# Altium schematic sheet 28_Clocks1.SchDoc: Clocks 1
size A3; Organization: Lime Microsystems; Address1: Surrey Tech Centre; Address2: Guildford GU2 7YG; Address3: Surrey; Address4: United Kingdom; Revision: v1.1; SheetNumber: 28; SheetTotal: 31
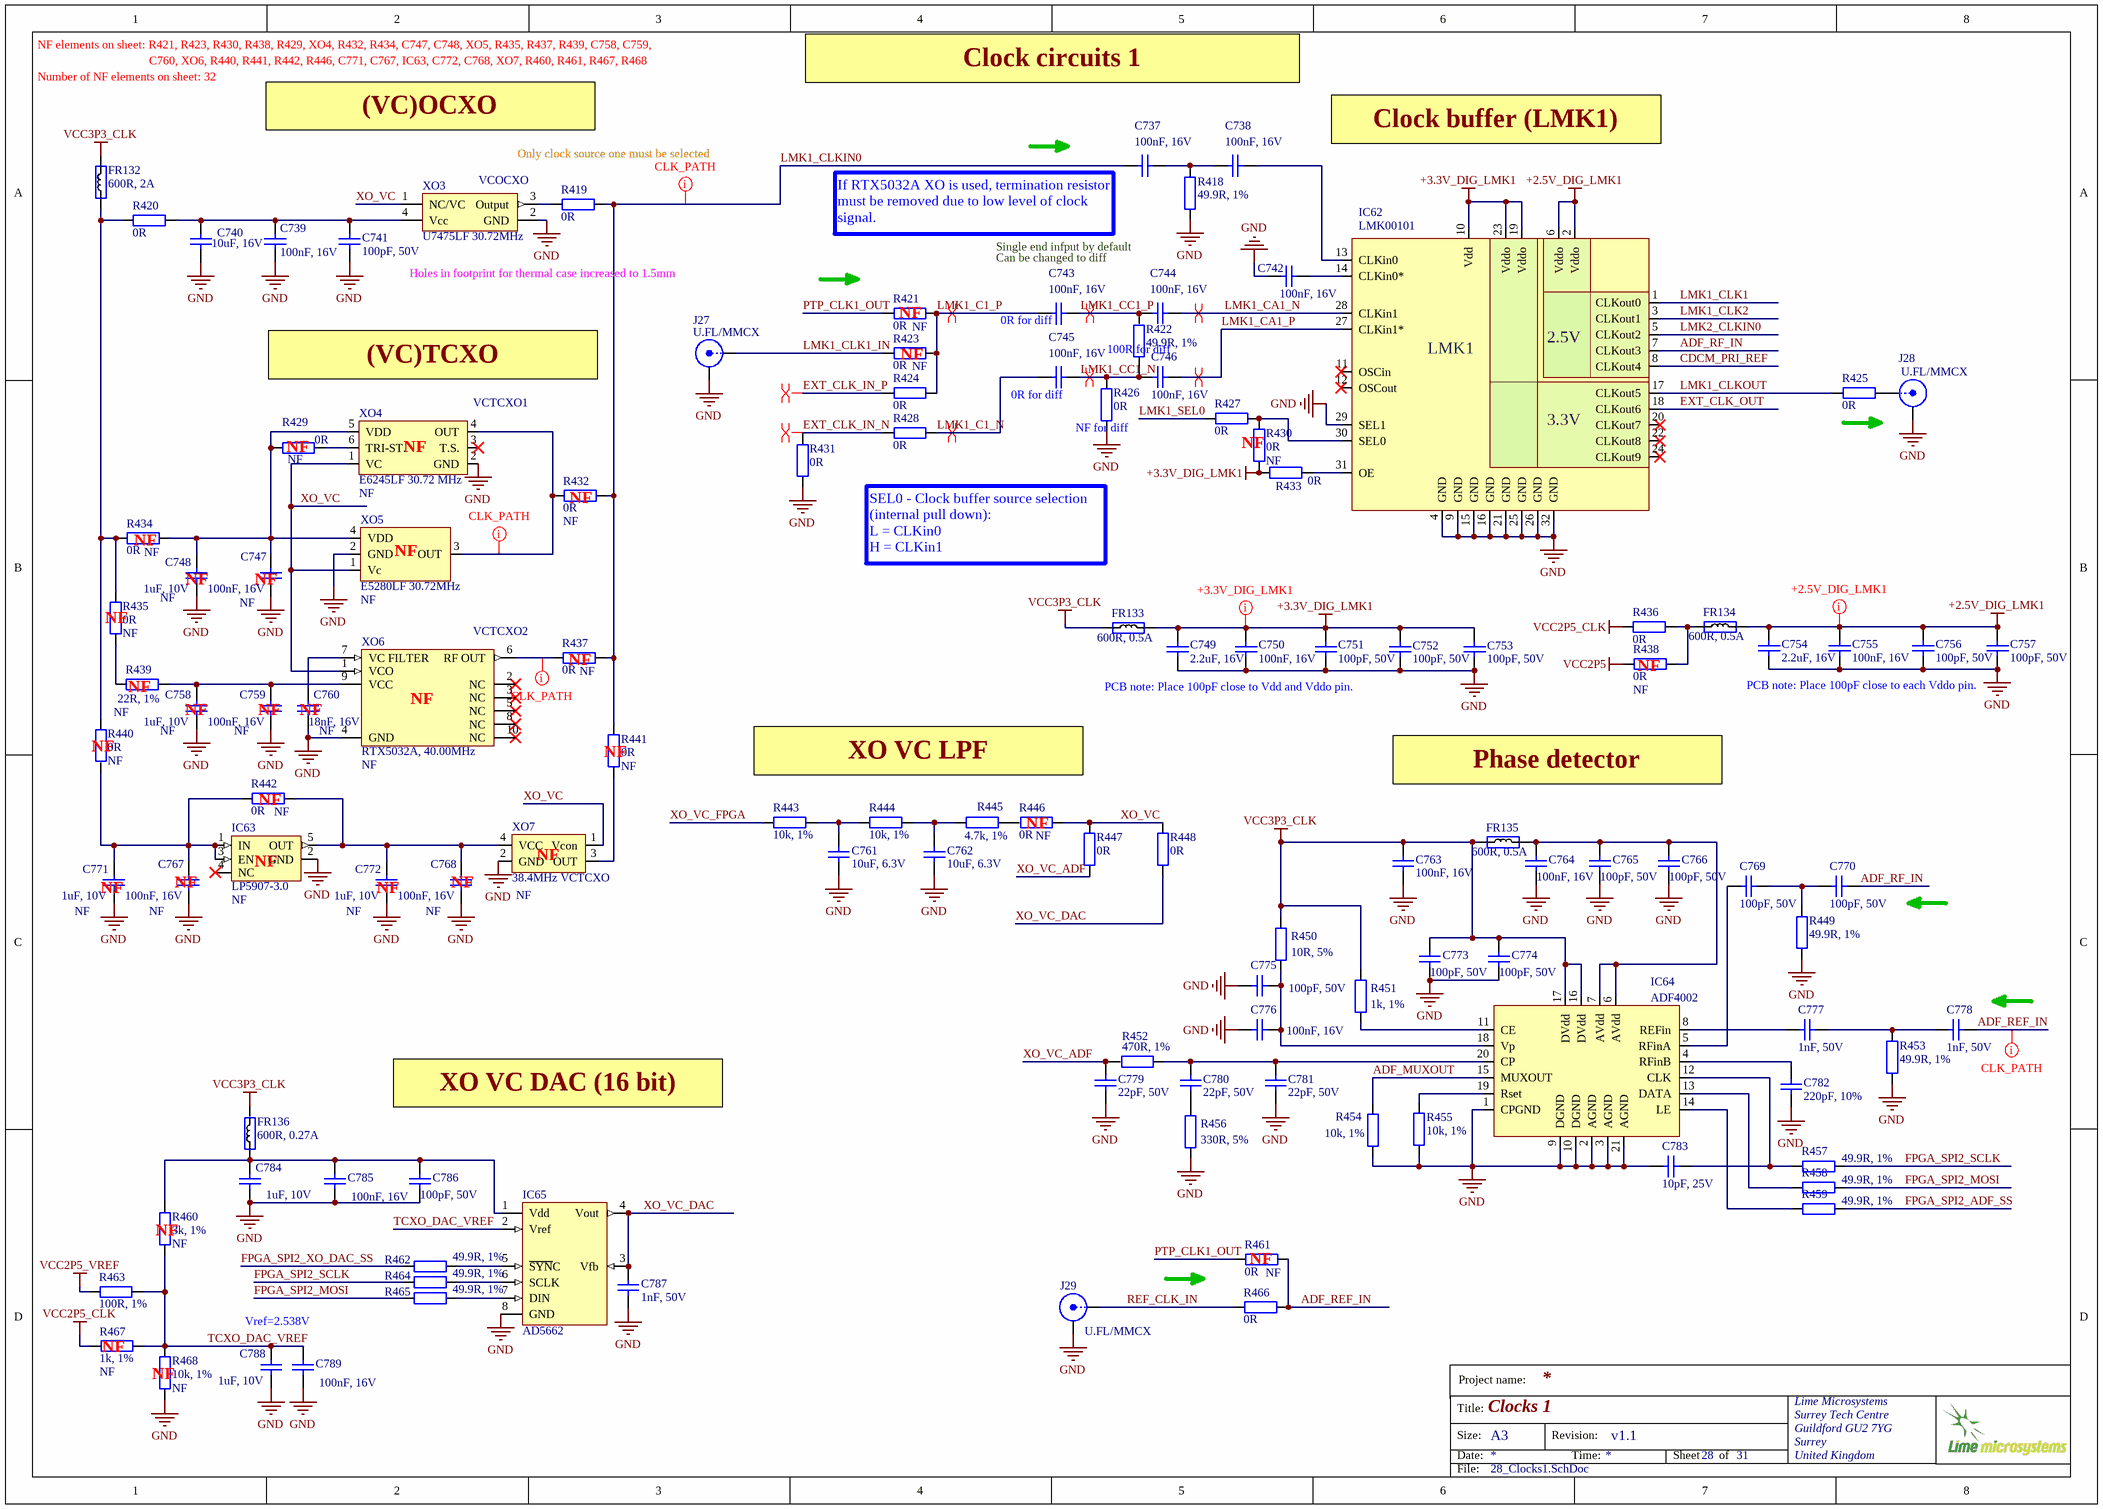
[diagram p0: 28_Clocks1.SchDoc]

## Parts
C737  100nF, 16V  [CAP0402]
C738  100nF, 16V  [CAP0402]
C739  100nF, 16V  [CAP0402]
C740  10uF, 16V  [CAP0603]
C741  100pF, 50V  [CAP0402]
C742  100nF, 16V  [CAP0402]
C743  100nF, 16V  [CAP0402]
C744  100nF, 16V  [CAP0402]
C745  100nF, 16V  [CAP0402]
C746  100nF, 16V  [CAP0402]
C747  100nF, 16V  Assembly Info: NF  [CAP0402]
C748  1uF, 10V  Assembly Info: NF  [CAP0402]
C749  2.2uF, 16V  [CAP0402]
C750  100nF, 16V  [CAP0402]
C751  100pF, 50V  [CAP0402]
C752  100pF, 50V  [CAP0402]
C753  100pF, 50V  [CAP0402]
C754  2.2uF, 16V  [CAP0402]
C755  100nF, 16V  [CAP0402]
C756  100pF, 50V  [CAP0402]
C757  100pF, 50V  [CAP0402]
C758  1uF, 10V  Assembly Info: NF  [CAP0402]
C759  100nF, 16V  Assembly Info: NF  [CAP0402]
C760  18nF, 16V  Assembly Info: NF  [CAP0402]
C761  10uF, 6.3V  [CAP0603]
C762  10uF, 6.3V  [CAP0603]
C763  100nF, 16V  [CAP0402]
C764  100nF, 16V  [CAP0402]
C765  100pF, 50V  [CAP0402]
C766  100pF, 50V  [CAP0402]
C767  100nF, 16V  Assembly Info: NF  [CAP0402]
C768  100nF, 16V  Assembly Info: NF  [CAP0402]
C769  100pF, 50V  [CAP0402]
C770  100pF, 50V  [CAP0402]
C771  1uF, 10V  Assembly Info: NF  [CAP0402]
C772  1uF, 10V  Assembly Info: NF  [CAP0402]
C773  100pF, 50V  [CAP0402]
C774  100pF, 50V  [CAP0402]
C775  100pF, 50V  [CAP0402]
C776  100nF, 16V  [CAP0402]
C777  1nF, 50V  [CAP0402]
C778  1nF, 50V  [CAP0402]
C779  22pF, 50V  [CAP0402]
C780  22pF, 50V  [CAP0402]
C781  22pF, 50V  [CAP0402]
C782  220pF, 10%  [CAP0402]
C783  10pF, 25V  [CAP0402]
C784  1uF, 10V  [CAP0402]
C785  100nF, 16V  [CAP0402]
C786  100pF, 50V  [CAP0402]
C787  1nF, 50V  [CAP0402]
C788  1uF, 10V  [CAP0402]
C789  100nF, 16V  [CAP0402]
FR132  600R, 2A  [RES0805]
FR133  value 600R, 0.5A  [RES0402]  (hidden comment: Ferrite)
FR134  value 600R, 0.5A  [RES0402]  (hidden comment: Ferrite)
FR135  value 600R, 0.5A  [RES0402]  (hidden comment: Ferrite)
FR136  value 600R, 0.27A  [RES0201]  (hidden comment: Ferrite)
IC62  LMK00101  [LMK00101_WQFN32]
IC63  LP5907-3.0  Assembly Info: NF  [SOT23-5]
IC64  ADF4002  [ADF4002]
IC65  AD5662  [AD5662_SOT23-8]
J27  U.FL/MMCX  [MMCX_UFL_conn_u]
J28  U.FL/MMCX  [MMCX_UFL_conn_u]
J29  U.FL/MMCX  [MMCX_UFL_conn_u]
R418  49.9R, 1%  [RES0402]
R419  0R  [RES0402_v2]
R420  0R  [RES0402]
R421  0R  Assembly Info: NF  [RES0402_v2]
R422  49.9R, 1%  [RES0402]
R423  0R  Assembly Info: NF  [RES0402_v2]
R424  0R  [RES0402_v2]
R425  0R  [RES0402]
R426  0R  [RES0402]
R427  0R  [RES0402]
R428  0R  [RES0402_v2]
R429  0R  Assembly Info: NF  [RES0402]
R430  0R  Assembly Info: NF  [RES0402]
R431  0R  [RES0402]
R432  0R  Assembly Info: NF  [RES0402_v2]
R433  0R  [RES0402]
R434  0R  Assembly Info: NF  [RES0402]
R435  0R  Assembly Info: NF  [RES0402]
R436  0R  [RES0402]
R437  0R  Assembly Info: NF  [RES0402_v2]
R438  0R  Assembly Info: NF  [RES0402]
R439  22R, 1%  Assembly Info: NF  [RES0402]
R440  0R  Assembly Info: NF  [RES0402]
R441  0R  Assembly Info: NF  [RES0402_v2]
R442  0R  Assembly Info: NF  [RES0402]
R443  10k, 1%  [RES0402]
R444  10k, 1%  [RES0402]
R445  4.7k, 1%  [RES0402]
R446  0R  Assembly Info: NF  [RES0402]
R447  0R  [RES0402]
R448  0R  [RES0402]
R449  49.9R, 1%  [RES0402]
R450  10R, 5%  [RES0402]
R451  1k, 1%  [RES0402]
R452  470R, 1%  [RES0402]
R453  49.9R, 1%  [RES0402]
R454  10k, 1%  [RES0402]
R455  10k, 1%  [RES0402]
R456  330R, 5%  [RES0402]
R457  49.9R, 1%  [RES0402]
R458  49.9R, 1%  [RES0402]
R459  49.9R, 1%  [RES0402]
R460  3k, 1%  Assembly Info: NF  [RES0402]
R461  0R  Assembly Info: NF  [RES0402]
R462  49.9R, 1%  [RES0402]
R463  100R, 1%  [RES0402]
R464  49.9R, 1%  [RES0402]
R465  49.9R, 1%  [RES0402]
R466  0R  [RES0402]
R467  1k, 1%  Assembly Info: NF  [RES0402]
R468  10k, 1%  Assembly Info: NF  [RES0402]
XO3  U7475LF 30.72MHz  [AOCJYR-10.000MHz]
XO4  E6245LF 30.72 MHz  Assembly Info: NF  [RAKON_RPT7050A]
XO5  E5280LF 30.72MHz  Assembly Info: NF  [RAKON_TXCO]
XO6  RTX5032A, 40.00MHz  Assembly Info: NF  [RAKON_RTX5032A]
XO7  38.4MHz VCTCXO  Assembly Info: NF  [CRYSTAL_4-LCC_2P5x2P0]

## Nets
+2.5V_DIG_LMK1: C754.2 C755.2 C756.2 C757.2 FR134.2 IC62.2(Vddo) IC62.6(Vddo)
+3.3V_DIG_LMK1: C749.2 C750.2 C751.2 C752.2 C753.2 FR133.2 IC62.10(Vdd) IC62.19(Vddo) IC62.23(Vddo) R430.2 R433.1
GND: C739.1 C740.1 C741.2 C742.1 C747.1 C748.1 C749.1 C750.1 C751.1 C752.1 C753.1 C754.1 C755.1 C756.1 C757.1 C758.1 C759.1 C760.1 C761.2 C762.2 C763.1 C764.1 C765.2 C766.2 C767.1 C768.1 C771.1 C772.1 C773.2 C774.2 C775.1 C776.2 C779.1 C781.1 C782.2 C783.1 C784.1 C785.2 C786.2 C787.2 C788.1 C789.2 IC62.4(GND) IC62.9(GND) IC62.15(GND) IC62.16(GND) IC62.21(GND) IC62.25(GND) IC62.26(GND) IC62.29(SEL1) IC62.32(GND) IC63.2(GND) IC64.1(CPGND) IC64.2(AGND) IC64.3(AGND) IC64.9(DGND) IC64.10(DGND) IC64.21(AGND) IC65.8(GND) J27.2(Y) J28.2(Y) J29.2(Y) R418.1 R426.1 R431.1 R449.1 R453.1 R454.2 R455.2 R456.1 R468.2 XO3.2(GND) XO4.2(GND) XO5.2(GND) XO6.4(GND) XO7.2(GND)
VCC2P5: R438.2
VCC2P5_CLK: R436.1 R467.2
VCC2P5_VREF: R463.1
VCC3P3_CLK: C763.2 C773.1 C774.1 FR132.1 FR133.1 FR135.1 FR136.2 IC64.16(DVdd) IC64.17(DVdd) R450.2 R451.2
ADF_MUXOUT: IC64.15(MUXOUT) R454.1
ADF_REF_IN: C778.1 R461.1 R466.2
ADF_RF_IN: C770.2 IC62.7(CLKout3)
CDCM_PRI_REF: IC62.8(CLKout4)
EXT_CLK_IN_N: R428.2 R431.2
EXT_CLK_IN_P: R424.2
EXT_CLK_OUT: IC62.18(CLKout6)
FPGA_SPI2_ADF_SS: R459.1
FPGA_SPI2_MOSI: R458.1 R465.2
FPGA_SPI2_SCLK: R457.1 R464.2
FPGA_SPI2_XO_DAC_SS: R462.2
LMK1_C1_N: C745.2 R428.1
LMK1_C1_P: C743.2 R421.1 R423.1 R424.1
LMK1_CA1_N: C744.1 IC62.28(CLKin1)
LMK1_CA1_P: C746.1 IC62.27(CLKin1*)
LMK1_CC1_N: C745.1 C746.2 R422.1 R426.2
LMK1_CC1_P: C743.1 C744.2 R422.2
LMK1_CLK1: IC62.1(CLKout0)
LMK1_CLK1_IN: J27.1(X) R423.2
LMK1_CLK2: IC62.3(CLKout1)
LMK1_CLKIN0: C737.2 R419.1 R432.1 R437.2 R441.1
LMK1_CLKOUT: IC62.17(CLKout5) R425.2
LMK1_SEL0: R427.1
LMK2_CLKIN0: IC62.5(CLKout2)
PTP_CLK1_OUT: R421.2 R461.2
REF_CLK_IN: J29.1(X) R466.1
TCXO_DAC_VREF: C788.2 C789.1 IC65.2(Vref) R460.1 R463.2 R467.1 R468.1
XO_VC: R446.1 R447.1 R448.1 XO3.1(NC/VC) XO4.1(VC) XO5.1(Vc) XO6.1(VCO) XO7.1(Vcon)
XO_VC_ADF: C779.2 R447.2 R452.2
XO_VC_DAC: C787.1 IC65.3(Vfb) IC65.4(Vout) R448.2
XO_VC_FPGA: R443.1
NetC737_1: C737.1 C738.2 R418.2
NetC738_1: C738.1 IC62.13(CLKin0)
NetC739_2: C739.2 C740.2 C741.1 R420.2 XO3.4(Vcc)
NetC742_2: C742.2 IC62.14(CLKin0*)
NetC747_2: C747.2 C748.2 R429.2 R434.1 XO4.5(VDD) XO5.4(VDD)
NetC758_2: C758.2 C759.2 R439.2 XO6.9(VCC)
NetC760_2: C760.2 XO6.7(VC_FILTER)
NetC761_1: C761.1 R443.2 R444.1
NetC762_1: C762.1 R444.2 R445.2
NetC764_2: C764.2 C765.1 C766.1 FR135.2 IC64.6(AVdd) IC64.7(AVdd)
NetC767_2: C767.2 C771.2 IC63.1(IN) IC63.3(EN) R440.2 R442.2
NetC768_2: C768.2 C772.2 IC63.5(OUT) R442.1 XO7.4(VCC)
NetC769_1: C769.1 IC64.5(RFinA)
NetC769_2: C769.2 C770.1 R449.2
NetC775_2: C775.2 C776.1 IC64.18(Vp) R450.1
NetC777_1: C777.1 C778.2 R453.2
NetC777_2: C777.2 IC64.8(REFin)
NetC780_1: C780.1 R456.2
NetC780_2: C780.2 C781.2 IC64.20(CP) R452.1
NetC782_1: C782.1 IC64.4(RFinB)
NetC783_2: C783.2 IC64.12(CLK) R457.2
NetC784_2: C784.2 C785.1 C786.1 FR136.1 IC65.1(Vdd) R460.2
NetFR132_2: FR132.2 R420.1 R434.2 R435.1 R440.1
NetFR134_1: FR134.1 R436.2 R438.1
NetIC62_30: IC62.30(SEL0) R427.2 R430.1
NetIC62_31: IC62.31(OE) R433.2
NetIC64_11: IC64.11(CE) R451.1
NetIC64_13: IC64.13(DATA) R458.2
NetIC64_14: IC64.14(LE) R459.2
NetIC64_19: IC64.19(Rset) R455.1
NetIC65_5: IC65.5(~{SYN}C) R462.1
NetIC65_6: IC65.6(SCLK) R464.1
NetIC65_7: IC65.7(DIN) R465.1
NetJ28_1: J28.1(X) R425.1
NetR419_2: R419.2 XO3.3(Output)
NetR429_1: R429.1 XO4.6(TRI-ST.)
NetR432_2: R432.2 XO4.4(OUT) XO5.3(OUT)
NetR435_2: R435.2 R439.1
NetR437_1: R437.1 XO6.6(RF_OUT)
NetR441_2: R441.2 XO7.3(OUT)
NetR445_1: R445.1 R446.2

Not connected (* = marked no-connect by the designer): IC62 11(OSCin)* 12(OSCout)* 20(CLKout7)* 22(CLKout8)* 24(CLKout9)*; IC63 4(NC)*; XO4 3(T.S.)*; XO6 2(NC)* 3(NC)* 5(NC)* 8(NC)* 10(NC)*

## Layout directives
net class CLK_PATH: ADF_REF_IN, LMK1_CLKIN0, NetR432_2, NetR437_1
net class +1.8V_DIG_LMK: +2.5V_DIG_LMK1
net class +3.3V_DIG_LMK: +3.3V_DIG_LMK1
differential pair: EXT_CLK_IN_N, EXT_CLK_IN_P, LMK1_C1_N, LMK1_C1_P, LMK1_CA1_N, LMK1_CA1_P, LMK1_CC1_N, LMK1_CC1_P

## Notes on the sheet
- NF elements on sheet: R421, R423, R430, R438, R429, XO4, R432, R434, C747, C748, XO5, R435, R437, R439, C758, C759,
- Number of NF elements on sheet: 32
- C760, XO6, R440, R441, R442, R446, C771, C767, IC63, C772, C768, XO7, R460, R461, R467, R468
- Clock circuits 1
- (VC)OCXO
- Only clock source one must be selected
- Clock buffer (LMK1)
- (near XO3) VCOCXO
- (near C737) If RTX5032A XO is used, termination resistor must be removed due to low level of clock signal.
- Single end infput by default
- Holes in footprint for thermal case increased to 1.5mm
- (near R421) NF
- Can be changed to diff
- (VC)TCXO
- (near R423) NF
- (near C743) 0R for diff
- (near R422) 100R for diff
- (near IC62) LMK1
- (near IC62) 2.5V
- (near R429) NF
- (near XO4) NF
- (near XO4) VCTCXO1
- (near C745) 0R for diff
- (near R426) NF for diff
- (near R430) NF
- (near IC62) 3.3V
- (near R432) NF
- (near R434) NF
- (near C748) NF
- (near C747) NF
- (near XO5) NF
- SEL0 - Clock buffer source selection (internal pull down):
  L = CLKin0
  H = CLKin1
- (near R435) NF
- (near XO6) VCTCXO2
- (near R439) NF
- (near C758) NF
- (near C759) NF
- (near C760) NF
- (near XO6) NF
- (near R437) NF
- PCB note: Place 100pF close to Vdd and Vddo pin.
- (near R438) NF
- PCB note: Place 100pF close to each Vddo pin.
- (near R440) NF
- (near R441) NF
- XO VC LPF
- Phase detector
- (near R442) NF
- (near R446) NF
- (near C771) NF
- (near C767) NF
- (near IC63) NF
- (near C772) NF
- (near C768) NF
- (near XO7) NF
- XO VC DAC (16 bit)
- (near R460) NF
- Vref=2.538V
- (near R461) NF
- (near R467) NF
- (near R468) NF
- Project name:
- Title:
- Size:
- Date:
- A3
- Revision:
- Time:
- Sheet
- of
- File:

## Library data of the parts
C737-C739 C742 C743 C745 C747 C750 C755 C759 C763 C764 C776 = Cap_0402: Manufacturer: Murata Electronics; Manufacturer Part Number: GRM155R71C104KA88D; Part Description: 0.10µF ±10% 16V X7R Ceramic Capacitor -55°C ~ 125°C Surface Mount, MLCC 0402 (1005 Metric) 0.039" L x 0.020" W (1.00mm x 0.50mm); Tolerance: 10 %; Type: General Purpose MLCC; Capacitance: 0.1 uF; Case Length: 1 mm; Dielectric: X7R; Case Height: 0.5 mm; Temperature Coefficient / Code: +/- 15 %; Value: 100nF, 16V; Supplier 1: Mouser; Supplier Part Number 1: 81-GRM155R71C104KA88; Case Code - in: 0402; RoHS: RoHS Compliant; Operating Temperature Range: - 55 C to + 125 C; Series: GRM; Termination Style: SMD/SMT; Package / Case: 0402 (1005 metric); Voltage Rating DC: 16 V; Maximum Operating Temperature: + 125 C; Case Code - mm: 1005; Minimum Operating Temperature: - 55 C; Product Category: Low & Medium Capacitance SMD Ceramic Chip Capacitors; Packaging: Reel; Product: General Type MLCCs; Category: Multilayer Ceramic Capacitors MLCC - SMD/SMT; Brand: Murata Electronics; Case Width: 0.5 mm; RoHS - Mouser: Y; Standard Pack Qty: 10000; Minimum Order Quantity: 1; Reeling: True; Manufacturer Part Number 1: GRM155R71C104KA88D
C740 = Cap_0603: Manufacturer: Yageo; Manufacturer Part Number 1: GRM188R61C106MA73D; Part Description: 10µF ±20% 16V Ceramic Capacitor X5R 0603 (1608 Metric); Temperature Coefficient: X5R; Capacitance: 10µF; Tolerance: ±20%; Value: 10uF, 16V; Supplier 1: Digi-Key; Supplier Part Number 1: 490-7201-2-ND; Category: Capacitors; Ratings: -; Features: -; Lead Style: -; Package / Case: 0603 (1608 Metric); Lead Spacing: -; Applications: General Purpose; Voltage - Rated: 16V; Operating Temperature: -55°C ~ 85°C; Thickness (Max): 0.039" (1.00mm); Mounting Type: Surface Mount, MLCC; RoHS: RoHS Compliant; Size / Dimension: 0.063" L x 0.031" W (1.60mm x 0.80mm); Packaging: Tape & Reel (TR); Height - Seated (Max): -
C741 = Cap_0402: Manufacturer Part Number 1: CC0402JRNPO9BN101; Manufacturer: Yageo; Part Description: 100pF ±5% 50V C0G, NP0 Ceramic Capacitor -55°C ~ 125°C Surface Mount, MLCC 0402 (1005 Metric) 0.039" L x 0.020" W (1.00mm x 0.50mm); Tolerance: ±5%; Temperature Coefficient: C0G, NP0; Value: 100pF, 50V; Capacitance: 100pF; Thickness (Max): 0.022" (0.55mm); Size / Dimension: 0.039" L x 0.020" W (1.00mm x 0.50mm); RoHS: RoHS Compliant; Ratings: -; Package / Case: 0402 (1005 Metric); Mounting Type: Surface Mount, MLCC; Height - Seated (Max): -; Features: -; Lead Spacing: -; Voltage - Rated: 50V; Operating Temperature: -55°C ~ 125°C; Packaging: Cut Tape (CT); Applications: General Purpose; Lead Style: -; Supplier 1: Digi-Key; Category: Capacitors; Supplier Part Number 1: 311-1024-1-ND
C744 C746 C767 C768 = Cap_0402: Manufacturer: Murata Electronics; Manufacturer Part Number 1: GRM155R71C104KA88D; Part Description: 0.10µF ±10% 16V X7R Ceramic Capacitor -55°C ~ 125°C Surface Mount, MLCC 0402 (1005 Metric) 0.039" L x 0.020" W (1.00mm x 0.50mm); Tolerance: 10 %; Type: General Purpose MLCC; Capacitance: 0.1 uF; Case Length: 1 mm; Dielectric: X7R; Case Height: 0.5 mm; Temperature Coefficient / Code: +/- 15 %; Value: 100nF, 16V; Supplier 1: Mouser; Supplier Part Number 1: 81-GRM155R71C104KA88; Case Code - in: 0402; RoHS: RoHS Compliant; Operating Temperature Range: - 55 C to + 125 C; Series: GRM; Termination Style: SMD/SMT; Package / Case: 0402 (1005 metric); Voltage Rating DC: 16 V; Maximum Operating Temperature: + 125 C; Case Code - mm: 1005; Minimum Operating Temperature: - 55 C; Product Category: Low & Medium Capacitance SMD Ceramic Chip Capacitors; Packaging: Reel; Product: General Type MLCCs; Category: Multilayer Ceramic Capacitors MLCC - SMD/SMT; Brand: Murata Electronics; Case Width: 0.5 mm; RoHS - Mouser: Y; Standard Pack Qty: 10000; Minimum Order Quantity: 1; Reeling: True
C748 C758 = Cap_0402: CAP CER 1UF 10V X5R 0402; Manufacturer: TDK; Part Description: 1µF ±10% 10V X5R Ceramic Capacitor -55°C ~ 85°C Surface Mount, MLCC 0402 (1005 Metric) 0.039" L x 0.020" W (1.00mm x 0.50mm); Manufacturer Part Number 1: C1005X5R1E105K050BC; Voltage Rating: 10; Capacitance: 1; Capacitance Tolerance: ± 10%; Ceramic Capacitor Case: 0402 [1005 Metric]; Dielectric Characteristic: X6; Product Range: TDK - C Series; Value: 1uF, 10V; Supplier 1: Digi-Key; Supplier Part Number 1: 445-9066-1-ND; RoHS: YES; MSL: -
C749 C754 = Cap_0402: CAP CER 2.2UF 16V 10% X5R 0402; Manufacturer Part Number 1: C1005X5R1C225K050BC; Manufacturer: TDK Corporation; Part Description: 2.2µF ±10% 16V Ceramic Capacitor X5R 0402 (1005 Metric); Capacitance: 2.2µF; Tolerance: ±20%; Capacitor Case Style: 0402 [1005 Metric]; Value: 2.2uF, 16V; Supplier 1: Digi-Key; Supplier Part Number 1: 445-9085-6-ND; Category: Capacitors; Voltage - Rated: 16V; Thickness (Max): 0.022" (0.55mm); Applications: General Purpose; Package / Case: 0402 (1005 Metric); Size / Dimension: 0.039" L x 0.020" W (1.00mm x 0.50mm); Features: -; Temperature Coefficient: X5R; Mounting Type: Surface Mount, MLCC; Ratings: -; Lead Style: -; Operating Temperature: -55°C ~ 85°C; Lead Spacing: -; RoHS: RoHS Compliant; Height - Seated (Max): -; Packaging: Tape & Reel (TR); Operating Temperature Range: -55°C to +85
C751-C753 C756 C757 = Cap_0402: Manufacturer Part Number 1: CC0402JRNPO9BN101; Manufacturer: Yageo; Part Description: 100pF ±5% 50V C0G, NP0 Ceramic Capacitor -55°C ~ 125°C Surface Mount, MLCC 0402 (1005 Metric) 0.039" L x 0.020" W (1.00mm x 0.50mm); Temperature Coefficient: C0G, NP0; Tolerance: ±5%; Value: 100pF, 50V; Supplier 1: Digi-Key; Supplier Part Number 1: 311-1024-1-ND; RoHS: RoHS Compliant; Category: Capacitors; Applications: General Purpose; Mounting Type: Surface Mount, MLCC; Capacitance: 100pF; Ratings: -; Packaging: Cut Tape (CT); Voltage - Rated: 50V; Size / Dimension: 0.039" L x 0.020" W (1.00mm x 0.50mm); Height - Seated (Max): -; Package / Case: 0402 (1005 Metric); Operating Temperature: -55°C ~ 125°C; Features: -; Lead Spacing: -; Lead Style: -; Thickness (Max): 0.022" (0.55mm)
C760 = Cap_0402: Manufacturer: Yageo; Manufacturer Part Number 1: CC0402KRX7R7BB183; Part Description: 0.018µF ±10% 16V Ceramic Capacitor X7R 0402 (1005 Metric); Temperature Coefficient: X7R; Capacitance: 0.018µF; Tolerance: ±10%; Value: 18nF, 16V; Supplier 1: Digi-Key; Supplier Part Number 1: 311-1706-1-ND; Part Status: Active; Category: Capacitors; Packaging: Cut Tape (CT); Voltage - Rated: 16V; RoHS: RoHS Compliant; Size / Dimension: 0.039" L x 0.020" W (1.00mm x 0.50mm); Package / Case: 0402 (1005 Metric); Mounting Type: Surface Mount, MLCC; Thickness (Max): 0.022" (0.55mm); Applications: General Purpose; Operating Temperature: -55°C ~ 125°C
C761 C762 = Cap_0603: Manufacturer Part Number 1: CC0603MRX5R5BB106; Manufacturer: Yageo; Part Description: 10µF ±20% 6.3V X5R Ceramic Capacitor -55°C ~ 85°C Surface Mount, MLCC 0603 (1608 Metric) 0.063" L x 0.031" W (1.60mm x 0.80mm); Capacitance: 10µF; Tolerance: ±20%; Supplier 1: Digi-Key; Supplier Part Number 1: 311-1448-2-ND; Package / Case: 0603 (1608 Metric); Category: Capacitors; Voltage - Rated: 6.3V; Value: 10uF, 6.3V
C765 C766 C769 C770 C773-C775 C786 = Cap_0402: Manufacturer: Yageo; Manufacturer Part Number 1: CC0402JRNPO9BN101; Part Description: 100pF ±5% 50V C0G, NP0 Ceramic Capacitor -55°C ~ 125°C Surface Mount, MLCC 0402 (1005 Metric) 0.039" L x 0.020" W (1.00mm x 0.50mm); Temperature Coefficient: C0G, NP0; Tolerance: ±5%; Value: 100pF, 50V; Supplier 1: Digi-Key; Supplier Part Number 1: 311-1024-1-ND; Category: Capacitors; Features: -; Operating Temperature: -55°C ~ 125°C; Capacitance: 100pF; Thickness (Max): 0.022" (0.55mm); RoHS: RoHS Compliant; Voltage - Rated: 50V; Lead Style: -; Ratings: -; Size / Dimension: 0.039" L x 0.020" W (1.00mm x 0.50mm); Height - Seated (Max): -; Applications: General Purpose; Package / Case: 0402 (1005 Metric); Lead Spacing: -; Packaging: Tape & Reel (TR); Mounting Type: Surface Mount, MLCC
C771 C772 C784 C788 = Cap_0402: Manufacturer Part Number 1: C1005X5R1E105K050BC; Manufacturer: TDK; Part Description: 1µF ±10% 10V X5R Ceramic Capacitor -55°C ~ 85°C Surface Mount, MLCC 0402 (1005 Metric) 0.039" L x 0.020" W (1.00mm x 0.50mm); Voltage Rating: 10; Capacitance Tolerance: ± 10%; Product Range: TDK - C Series; Ceramic Capacitor Case: 0402 [1005 Metric]; Capacitance: 1; Dielectric Characteristic: X6; Value: 1uF, 10V; Supplier 1: Digi-Key; Supplier Part Number 1: 445-9066-1-ND; MSL: -; RoHS: YES
C777 C778 C787 = Cap_0402: Manufacturer Part Number 1: GCM155R71H102KA37D; Part Description: 1000pF ±10% 50V X7R Ceramic Capacitor -55°C ~ 125°C Surface Mount, MLCC 0402 (1005 Metric) 0.039" L x 0.020" W (1.00mm x 0.50mm); Capacitance: 1000 pF; Type: Automotive Ultra Small MLCC; Tolerance: 10 %; Brand: Murata Electronics; Case Height: 0.5 mm; Case Length: 1 mm; Dielectric: X7R; Temperature Coefficient / Code: +/- 15 %; Value: 1nF, 50V; Supplier 1: Mouser; Supplier Part Number 1: 81-GCM155R71H102KA7D; Case Code - in: 0402; Package / Case: 0402 (1005 metric); Termination Style: SMD/SMT; Packaging: Reel; Operating Temperature Range: - 55 C to + 125 C; Maximum Operating Temperature: + 125 C; Manufacturer: Murata Electronics; Category: Multilayer Ceramic Capacitors MLCC - SMD/SMT; RoHS: RoHS Compliant; Series: GCM; Case Width: 0.5 mm; Voltage Rating DC: 50 V; Case Code - mm: 1005; Product: Automotive MLCCs; Standard Pack Qty: 10000; Reeling: True; RoHS - Mouser: Y; Minimum Order Quantity: 1; Product Category: Automotive Ceramic Chip Capacitors; Minimum Operating Temperature: - 55 C
C779-C781 = Cap_0402: Manufacturer: Yageo; Manufacturer Part Number 1: CC0402JRNPO9BN220; Part Description: 22pF ±5% 50V C0G, NP0 Ceramic Capacitor -55°C ~ 125°C Surface Mount, MLCC 0402 (1005 Metric) 0.039" L x 0.020" W (1.00mm x 0.50mm); Tolerance: ±5%; Temperature Coefficient: C0G, NP0; Value: 22pF, 50V; Supplier 1: Digi-Key; Supplier Part Number 1: 311-1018-2-ND; Category: Capacitors; Voltage - Rated: 50V; Packaging: Tape & Reel (TR); RoHS: RoHS Compliant; Capacitance: 22pF; Operating Temperature: -55°C ~ 125°C; Mounting Type: Surface Mount, MLCC; Height - Seated (Max): -; Size / Dimension: 0.039" L x 0.020" W (1.00mm x 0.50mm); Ratings: -; Applications: General Purpose; Thickness (Max): 0.022" (0.55mm); Lead Spacing: -; Lead Style: -; Features: -; Package / Case: 0402 (1005 Metric)
C782 = Cap_0402: Manufacturer Part Number 1: CC0402KRX7R9BB221; Manufacturer: Yageo; Part Description: 220pF ±10% 50V X7R Ceramic Capacitor -55°C ~ 125°C Surface Mount, MLCC 0402 (1005 Metric) 0.039" L x 0.020" W (1.00mm x 0.50mm); Temperature Coefficient: X7R; Voltage - Rated: 50V; Value: 220pF, 10%; Supplier 1: Digi-Key; Supplier Part Number 1: 311-1035-2-ND; Category: Capacitors; Ratings: -; RoHS: RoHS Compliant; Packaging: Tape & Reel (TR); Mounting Type: Surface Mount, MLCC; Applications: General Purpose; Capacitance: 220pF; Tolerance: ±10%; Operating Temperature: -55°C ~ 125°C; Package / Case: 0402 (1005 Metric); Lead Spacing: -; Size / Dimension: 0.039" L x 0.020" W (1.00mm x 0.50mm); Thickness (Max): 0.022" (0.55mm); Height - Seated (Max): -; Lead Style: -; Features: -
C783 = Cap_0402: Manufacturer Part Number 1: 04023A100JAT2A; Manufacturer: AVX; Part Description: 10pF ±5% 25V C0G, NP0 Ceramic Capacitor -55°C ~ 125°C Surface Mount, MLCC 0402 (1005 Metric) 0.039" L x 0.020" W (1.00mm x 0.50mm); Capacitance Tolerance: ± 5%; Voltage Rating: 25; Ceramic Capacitor Case: 0402 [1005 Metric]; Capacitor Case Style: 0402 [1005 Metric]<!--FANDB--><div class="features-and-benefits-container"></div>; Dielectric Characteristic: C0G / NP0; SVHC: No SVHC (16-Jun-2014); Capacitance: 10; Value: 10pF, 25V; Supplier 1: Farnell; Supplier Part Number 1: 2332478RL; Product Range: -; RoHS: YES; Operating Temperature Min: -55; Operating Temperature Max: 125; Capacitance Tolerance ±: ± 5%; MSL: MSL 1 - Unlimited; Packaging: Cut Tape
C785 C789 = Cap_0603: Manufacturer Part Number 1: GRM155R71C104KA88D; Part Description: 0.10µF ±10% 16V X7R Ceramic Capacitor -55°C ~ 125°C Surface Mount, MLCC 0402 (1005 Metric) 0.039" L x 0.020" W (1.00mm x 0.50mm); Brand: Murata Electronics; Tolerance: 10 %; Type: General Purpose MLCC; Capacitance: 0.1 uF; Temperature Coefficient / Code: +/- 15 %; Case Height: 0.5 mm; Case Length: 1 mm; Dielectric: X7R; Supplier 1: Mouser; Supplier Part Number 1: 81-GRM155R71C104KA88; Case Code - in: 0402; Manufacturer: Murata Electronics; Category: Multilayer Ceramic Capacitors MLCC - SMD/SMT; Voltage Rating DC: 16 V; Value: 100nF, 16V; Case Code - mm: 1005; Case Width: 0.5 mm; Maximum Operating Temperature: + 125 C; Minimum Operating Temperature: - 55 C; Minimum Order Quantity: 1; Operating Temperature Range: - 55 C to + 125 C; Package / Case: 0402 (1005 metric); Packaging: Reel; Product: General Type MLCCs; Product Category: Low & Medium Capacitance SMD Ceramic Chip Capacitors; Reeling: True; RoHS - Mouser: Y; RoHS: RoHS Compliant; Series: GRM; Standard Pack Qty: 10000; Termination Style: SMD/SMT
FR132 = Ferrite: Manufacturer Part Number 1: MPZ2012S601AT000; Manufacturer: TDK Corporation; Part Description: FERRITE BEAD 600 OHM 0805 1LN; DC Resistance (DCR): 100 mOhm Max; Filter Type: Differential Mode - Single; Impedance @ Frequency: 600 Ohm @ 100MHz; Supplier 1: Digi-Key; Supplier Part Number 1: 445-2206-2-ND; Value: 600R, 2A; Category: Filters; Current Rating: 2A; Height (Max): 0.041" (1.05mm); Mounting Type: Surface Mount; Package / Case: 0805 (2012 Metric); Packaging: Tape & Reel (TR); RoHS: RoHS Compliant; Size / Dimension: 0.079" L x 0.049" W (2.00mm x 1.25mm)
FR133-FR135 = Ferrite: Manufacturer: Murata; Manufacturer Part Number 1: BLM15AX601SN1D; Part Description: - Ferrite Bead 0402 (1005 Metric) 500mA 340mOhm; Tolerance: 25%; Impedance: 600R; Current Rating: 500mA; Number of Lines: 1; DC Resistance (DCR): 340mR; Test Frequency: 100MHz; Supplier 1: Digi-Key; Supplier Part Number 1: 490-5441-1-ND; Stock 1: 416370; Pricing 1: 1=0.1, 10=0.06, 25=0.0552, 50=0.0496, 100=0.0363, 250=0.0264, 500=0.0242, 1000=0.0209, 5000=0.0165 (USD); Case/Package: 0402; Number of Pins: 2; Case Code (Metric): 1005; Case Code (Imperial): 0402; Core Material: Ferrite; Material: Steel,Ferrite; Min Operating Temperature: -55°C; Max Operating Temperature: 125°C; Package Quantity: 1; Packaging: Tape and Reel; Series: BLM15AX_SN; Max Current Rating: 500mA; Termination: SMD/SMT; Max DC Current: 500mA; Number of Circuits: 1; DC Resistance-Max: 340mR; Length: 1mm; Width: 0.5mm; Height: 0.5mm; Depth: 0.5mm; REACH SVHC: No SVHC; Lead Free: Lead Free; RoHS Compliant: Yes; ComponentLink1URL: https://www.murata.com/en-us/products/productdata/8796740059166/ENFA0018.pdf?src-supplier=Digi-Key; ComponentLink1Description: https://www.murata.com/en-us/products/productdata/8796740059166/ENFA0018.pdf?src-supplier=Digi-Key; ComponentLink2URL: http://search.murata.co.jp/Ceramy/image/img/PDF/ENG/L0110S0100BLM15AX_SN.pdf?src-supplier=Future+Electronics; ComponentLink2Description: http://search.murata.co.jp/Ceramy/image/img/PDF/ENG/L0110S0100BLM15AX_SN.pdf?src-supplier=Future+Electronics; ComponentLink3URL: http://www.produktinfo.conrad.com/datenblaetter/1100000-1199999/001171675-da-01-en-CHIP_DROSSEL0402_600R_420MA_1_0X0_5MM.pdf?src-supplier=Conrad; ComponentLink3Description: http://www.produktinfo.conrad.com/datenblaetter/1100000-1199999/001171675-da-01-en-CHIP_DROSSEL0402_600R_420MA_1_0X0_5MM.pdf?src-supplier=Conrad; ComponentLink4URL: http://www.produktinfo.conrad.com/datenblaetter/1100000-1199999/001172169-da-01-en-DROSSEL_0402_600R_1_0X0_5MM_10000ST.pdf?src-supplier=Conrad; ComponentLink4Description: http://www.produktinfo.conrad.com/datenblaetter/1100000-1199999/001172169-da-01-en-DROSSEL_0402_600R_1_0X0_5MM_10000ST.pdf?src-supplier=Conrad
FR136 = Ferrite: Manufacturer Part Number 1: BK0603TS601-T; Manufacturer: Taiyo Yuden; Part Description: FERRITE BEAD 600 OHM 0201 1LN; DC Resistance (DCR): 750 mOhm Max; Filter Type: Differential Mode - Single; Impedance @ Frequency: 600 Ohm @ 100MHz; Current Rating: 270mA; Supplier 1: Digi-Key; Supplier Part Number 1: 587-3277-1-ND; Size / Dimension: 0.024" L x 0.012" W (0.60mm x 0.30mm); Package / Case: 0201 (0603 Metric); Height (Max): 0.013" (0.33mm); Mounting Type: Surface Mount; Packaging: Cut Tape (CT); RoHS: RoHS Compliant; Category: Filters
IC62 = LMK00101: Manufacturer: Texas Instruments; Manufacturer Part Number 1: LMK00101SQE/NOPB; Part Description: Clock Fanout Buffer (Distribution), Multiplexer, Translator IC 200MHz 32-WFQFN Exposed Pad; Input: HCSL, LVCMOS, LVDS, LVPECL, LVTTL, SSTL, Crystal; Frequency - Max: 200MHz; Output: LVCMOS, LVTTL; Ratio - Input:Output: 3:10; Number of Circuits: 1; Voltage - Supply: 2.375 V ~ 3.45 V; Differential - Input:Output: Yes/No; Supplier 1: Digi-Key; Mounting Type: Surface Mount; Package / Case: 32-WFQFN Exposed Pad; RoHS: RoHS Compliant; Operating Temperature: -40°C ~ 85°C; Type: Fanout Buffer (Distribution), Multiplexer, Translator; Category: Integrated Circuits (ICs); Packaging: Cut Tape (CT); Supplier Device Package: 32-WQFN (5x5); Supplier Part Number 1: 296-39036-1-ND
IC63 = LP5907: Manufacturer: Texas Instruments; Manufacturer Part Number 1: LP5907QMFX-3.0Q1; Part Description: Linear Voltage Regulator IC Positive Fixed 1 Output  250mA SOT-23-5; Number of Outputs: 1; Min Input Voltage: 2.2V; Max Input Voltage: 5.5V; Max Output Current: 250mA; Output Voltage: 3V; Dropout Voltage: 50mV; Polarity: Positive; Quiescent Current: 425uA; Accuracy: 2%; Output Type: Fixed; Supplier 1: Digi-Key; Stock 1: 90911; Pricing 1: 1 = 0,65000, 10 = 0,56000, 100 = 0,41820, 500 = 0,32858, 1000 = 0,25390 (USD); RoHS: Yes; Mount: Surface Mount; Case/Package: SOT-23-5; Min Operating Temperature: -40°C; Max Operating Temperature: 125°C; Packaging: Tape and Reel; Output Current: 250mA; Number of Regulators: 1; Radiation Hardening: No; Lead Free: Lead Free; ComponentLink1URL: https://datasheet.ciiva.com/48677/lp5907-q1-48677562.pdf?src-supplier=Avnet; ComponentLink1Description: https://datasheet.ciiva.com/48677/lp5907-q1-48677562.pdf?src-supplier=Avnet; Supplier Part Number 1: 296-40364-1-ND
IC64 = ADF4002: Manufacturer: Analog Devices Inc; Manufacturer Part Number 1: ADF4002BCPZ-RL7; Part Description: IC PLL FREQUENCY SYNTH 20-LFCSP; Ratio - Input:Output: 2:1; Differential - Input:Output: Yes/No; Input: CMOS, TTL; Voltage - Supply: 2.7 V ~ 3.3 V; Supplier 1: Digi-Key; Supplier: Digi-Key; Category: Integrated Circuits (ICs); Type: Clock/Frequency Synthesizer (RF), Phase Detector; Operating Temperature: -40°C ~ 85°C; Mounting Type: Surface Mount; Package / Case: 20-VFQFN Exposed Pad, CSP; Supplier Part Number 1: ADF4002BCPZ-RL7CT-ND
IC65 = AD5662: Manufacturer: Analog Devices Inc.; Manufacturer Part Number 1: AD5662BRJZ-2REEL7; Part Description: IC DAC 16BIT BUFF V-OUT SOT23-8; Number of Bits: 16; Number of D/A Converters: 1; Settling Time: 10µs; Output Type: Voltage - Buffered; Differential Output: No; Data Interface: SPI, DSP; Reference Type: External; Voltage - Supply, Analog: 2.7 V ~ 5.5 V; INL/DNL (LSB): ±8, ±1 (Max); Architecture: String DAC; Supplier 1: Digi-Key; RoHS: RoHS Compliant; Category: Integrated Circuits (ICs); Stock 1: 2784; Pricing 1: 1=7.55, 10=6.821, 100=5.6469, 500=4.91722, 1000=4.28274 (USD); Packaging: Cut Tape (CT); Part Status: Active; Voltage - Supply, Digital: 2.7 V ~ 5.5 V; Operating Temperature: -40°C ~ 125°C; Package / Case: SOT-23-8; Supplier Device Package: SOT-23-8; ComponentLink1URL: http://www.analog.com/media/en/technical-documentation/data-sheets/AD5662.pdf; ComponentLink1Description: http://www.analog.com/media/en/technical-documentation/data-sheets/AD5662.pdf; Supplier Part Number 1: AD5662BRJZ-2REEL7CT-ND
J27-J29 = RF_IF_connector: CONN UMC RCPT STR 50 OHM SMD; Manufacturer: Molex, LLC; Manufacturer Part Number 1: 0734120110; Body Finish: Nickel; Body Material: Phosphor Bronze; Center Contact Material: Brass; Center Contact Plating: Gold; Connector Style: Ultra Miniature Coaxial; Connector Type: Jack, Male Pin; Contact Termination: Solder; Dielectric Material: Liquid Crystal Polymer (LCP); Frequency - Max: 6GHz; Impedance: 50 Ohm; Voltage Rating: 60V; Cable Group: -; Category: Connectors, Interconnects; Fastening Type: Snap-On; Features: -; Housing Color: Silver; Ingress Protection: -; Mounting Type: Surface Mount; Operating Temperature: -40°C ~ 90°C; Packaging: Cut Tape (CT); RoHS: RoHS Compliant; Shield Termination: Solder; Supplier 1: Digi-Key; Supplier Part Number 1: WM5587CT-ND; Part Description: CONN UMC RCPT STR 50 OHM SMD
R418 R422 R462 R464 R465 = Res_0402: Manufacturer: Samsung Electro-Mechanics America, Inc.; Part Description: RES SMD 49.9 OHM 1% 1/16W 0402; Manufacturer Part Number 1: RC1005F49R9CS; Temperature Coefficient: ±100ppm/°C; Resistance (Ohms): 49.9; Power (Watts): 0.063W, 1/16W; Number of Terminations: 2; Size / Dimension: 0.039" L x 0.020" W (1.00mm x 0.50mm); Supplier Device Package: 0402 (1005 Metric); RoHS: RoHS Compliant; Supplier Part Number 1: 1276-3469-6-ND; Features: -; Packaging: Digi-Reel®; Tolerance: ±1%; Height: 0.016" (0.40mm); Category: Resistors; Composition: Thick Film; Package / Case: 0402 (1005 Metric); Supplier 1: Digi-Key; Operating Temperature: -55°C ~ 155°C; Value: 49.9R, 1%
R419-R421 R423-R438 R440-R442 R446-R448 R461 R466 = Res_0402: Manufacturer Part Number 1: RC0402JR-070RL; Manufacturer: Yageo; Part Description: RES SMD 0.0OHM JUMPER 1/16W 0402; Resistance (Ohms): 0.0; Tolerance: Jumper; Power (Watts): 0.063W, 1/16W; Value: 0R; Supplier 1: Digi-Key; Supplier Part Number 1: 311-0.0JRTR-ND; Category: Resistors; Temperature Coefficient: -; Features: Moisture Resistant; Supplier Device Package: 0402; Height: 0.016" (0.40mm); Package / Case: 0402 (1005 Metric); Operating Temperature: -55°C ~ 155°C; Size / Dimension: 0.039" L x 0.020" W (1.00mm x 0.50mm); Composition: Thick Film; Packaging: Tape & Reel (TR); Number of Terminations: 2; RoHS: RoHS Compliant
R439 = Res_0402: Part Description: RES SMD 22 OHM 1% 1/16W 0402; Manufacturer Part Number 1: RC0402FR-0722RL; Manufacturer: Yageo; Temperature Coefficient: ±100ppm/°C; Resistance (Ohms): 22; Supplier 1: Digi-Key; Supplier Part Number 1: 311-22.0LRTR-ND; Tolerance: ±1%; Supplier Device Package: 0402; Composition: Thick Film; Category: Resistors; Value: 22R, 1%
R443 R444 R454 R455 R468 = Res_0402: Manufacturer: Yageo; Manufacturer Part Number 1: RC0402FR-0710KL; Part Description: RES SMD 10K OHM 1% 1/16W 0402; Temperature Coefficient: ±100ppm/°C; Power (Watts): 0.063W, 1/16W; Value: 10k, 1%; Supplier 1: Digi-Key; Supplier Part Number 1: 311-10.0KLRTR-ND; Resistance (Ohms): 10k; Packaging: Tape & Reel (TR); RoHS: RoHS Compliant; Package / Case: 0402 (1005 Metric); Tolerance: ±1%; Operating Temperature: -55°C ~ 155°C; Size / Dimension: 0.039" L x 0.020" W (1.00mm x 0.50mm); Number of Terminations: 2; Category: Resistors; Height: 0.016" (0.40mm); Supplier Device Package: 0402; Features: Moisture Resistant; Composition: Thick Film
R445 = Res_0402: Manufacturer: Yageo; Part Description: RES SMD 4.7K OHM 1% 1/16W 0402; Manufacturer Part Number 1: RC0402FR-074K7L; Temperature Coefficient: ±100ppm/°C; Power (Watts): 0.063W, 1/16W; Number of Terminations: 2; Category: Resistors; Supplier 1: Digi-Key; Height: 0.016" (0.40mm); Features: Moisture Resistant; Size / Dimension: 0.039" L x 0.020" W (1.00mm x 0.50mm); Supplier Device Package: 0402; RoHS: RoHS Compliant; Composition: Thick Film; Package / Case: 0402 (1005 Metric); Resistance (Ohms): 4.7k; Operating Temperature: -55°C ~ 155°C; Tolerance: ±1%; Supplier Part Number 1: 311-4.7KLRCT-ND; Packaging: Cut Tape (CT); Value: 4.7k, 1%
R449 R453 R457-R459 = Res_0402: Manufacturer: Samsung Electro-Mechanics America, Inc.; Manufacturer Part Number: RC1005F49R9CS; Part Description: RES SMD 49.9 OHM 1% 1/16W 0402; Temperature Coefficient: ±100ppm/°C; Resistance (Ohms): 49.9; Power (Watts): 0.063W, 1/16W; Number of Terminations: 2; Size / Dimension: 0.039" L x 0.020" W (1.00mm x 0.50mm); Supplier Device Package: 0402 (1005 Metric); RoHS: RoHS Compliant; Supplier Part Number 1: 1276-3469-6-ND; Features: -; Packaging: Digi-Reel®; Tolerance: ±1%; Height: 0.016" (0.40mm); Category: Resistors; Composition: Thick Film; Package / Case: 0402 (1005 Metric); Supplier 1: Digi-Key; Operating Temperature: -55°C ~ 155°C; Value: 49.9R, 1%; Manufacturer Part Number 1: RC1005F49R9CS
R450 = Res_0402: Manufacturer Part Number 1: RC0402JR-0710RL; Manufacturer: Yageo; Part Description: RES SMD 10 OHM 5% 1/16W 0402; Power (Watts): 0.063W, 1/16W; Resistance (Ohms): 10; Temperature Coefficient: ±200ppm/°C; Value: 10R, 5%; Supplier 1: Digi-Key; Supplier Part Number 1: 311-10JRTR-ND; Number of Terminations: 2; Height: 0.016" (0.40mm); RoHS: RoHS Compliant; Composition: Thick Film; Packaging: Tape & Reel (TR); Category: Resistors; Supplier Device Package: 0402; Features: Moisture Resistant; Tolerance: ±5%; Operating Temperature: -55°C ~ 155°C; Size / Dimension: 0.039" L x 0.020" W (1.00mm x 0.50mm); Package / Case: 0402 (1005 Metric)
R451 R467 = Res_0402: Manufacturer: Stackpole Electronics Inc; Manufacturer Part Number 1: RMCF0402FT1K00; Part Description: RES SMD 1K OHM 1% 1/16W 0402; Temperature Coefficient: ±100ppm/°C; Power (Watts): 0.063W, 1/16W; Value: 1k, 1%; Supplier 1: Digi-Key; Supplier Part Number 1: RMCF0402FT1K00TR-ND; Resistance (Ohms): 1k; Packaging: Tape & Reel (TR); Category: Resistors; RoHS: RoHS Compliant; Tolerance: ±1%; Height: 0.016" (0.40mm); Number of Terminations: 2; Package / Case: 0402 (1005 Metric); Operating Temperature: -55°C ~ 155°C; Features: -; Composition: Thick Film; Supplier Device Package: 0402; Size / Dimension: 0.039" L x 0.020" W (1.00mm x 0.50mm)
R452 = Res_0402: Manufacturer 1: Yageo; Manufacturer Part Number 1: RC0402FR-07470RL; Part Description: 470 Ohms ±1% 0.063W, 1/16W Chip Resistor 0402 (1005 Metric) Moisture Resistant Thick Film; Power Rating: 62.5mW; Temperature Coefficient: 100ppm/°C; Voltage Rating: 50V; Max Power Dissipation: 63mW; Value: 470R, 1%; Supplier 1: Digi-Key; Supplier Part Number 1: 311-470LRCT-ND; Stock 1: 1652476; Pricing 1: 1=0,10000, 10=0,01600, 100=0,00660, 1000=0,00299, 2500=0,00259, 5000=0,00214 (USD); RoHS: Yes; Case/Package: 0402; Case Code (Metric): 1005; Case Code (Imperial): 0402; Size Code: 0402; Min Operating Temperature: -55°C; Max Operating Temperature: 155°C; Packaging: Tape and Reel; Tolerance: 1%; Resistance: 470R; Number of Terminations: 2; Features: Moisture Resistant; Package Quantity: 1; Resistor Type: Thick Film; Termination: SMD/SMT; Series: RC; Resistance Tolerance: 1%; Construction: Rectangular; Length: 1mm; Width: 0.02inch; Height: 0.016inch; Depth: 0.5mm; Lead Free: Lead Free; REACH SVHC: Unknown; Military Standard: Not; RoHS Compliant: Yes
R456 = Res_0402: Manufacturer: Yageo; Manufacturer Part Number 1: RC0402JR-07330RL; Part Description: RES SMD 330 OHM 5% 1/16W 0402; Power (Watts): 0.063W, 1/16W; Resistance (Ohms): 330; Temperature Coefficient: ±100ppm/°C; Value: 330R, 5%; Supplier 1: Digi-Key; Supplier Part Number 1: 311-330JRTR-ND; Composition: Thick Film; Supplier Device Package: 0402; Package / Case: 0402 (1005 Metric); Size / Dimension: 0.039" L x 0.020" W (1.00mm x 0.50mm); Features: Moisture Resistant; Height: 0.016" (0.40mm); Packaging: Tape & Reel (TR); RoHS: RoHS Compliant; Tolerance: ±5%; Category: Resistors; Number of Terminations: 2; Operating Temperature: -55°C ~ 155°C
R460 = Res_0402: Manufacturer: Vishay Dale; Part Description: RES SMD 3K OHM 1% 1/16W 0402; Manufacturer Part Number 1: CRCW04023K00FKED; Temperature Coefficient: ±100ppm/°C; Power (Watts): 0.063W, 1/16W; Value: 3k, 1%; Category: Resistors; Tolerance: ±1%; RoHS: RoHS Compliant; Composition: Thick Film; Number of Terminations: 2; Operating Temperature: -55°C ~ 155°C; Supplier Device Package: 0402 (1005 Metric); Supplier Part Number 1: 541-3.00KLCT-ND; Packaging: Cut Tape (CT); Supplier 1: Digi-Key; Package / Case: 0402 (1005 Metric); Features: Automotive AEC-Q200; Resistance (Ohms): 3k; Height: 0.016" (0.40mm); Size / Dimension: 0.039" L x 0.020" W (1.00mm x 0.50mm)
R463 = Res_0402: Manufacturer Part Number 1: RMCF0402FT100R; Part Description: RES SMD 100 OHM 1% 1/16W 0402; Manufacturer: Stackpole Electronics Inc.; Temperature Coefficient: ±100ppm/°C; Supplier 1: Digi-Key; Supplier Part Number 1: RMCF0402FT100RDKR-ND; Package / Case: 0402 (1005 Metric); Composition: Thick Film; Category: Resistors; Tolerance: ±1%; Value: 100R, 1%
XO3 = AOCJYR-10.000MHz: Manufacturer: Rakon; Part Description: ROM9070SA 30.72MHz MERC+ 9x7 HOT RC2.5 3.3V PULL; Oscillator Output Compatibility: CMOS; Oscillator Case: SMD, 9.7mm x 7.5; Supply Voltage Nom: 3.3; Frequency Nom, MHz: 30.72; Frequency Stability +/-, ppb: 20; Manufacturer Part Number 1: U7475LF 30.72MHz; Supplier Part Number 1: U7475LF; Supplier 1: Rakon
XO4 = RPT7050A: Part Description: TCXO 30.72MHz, E6245LF; Manufacturer: Rakon; Manufacturer Part Number 1: E6245LF; Supplier 1: Rakon; Supplier Part Number 1: E6245LF
XO5 = TXCO: Part Description: TCXO 30.72MHz, E5280LF; Manufacturer: Rakon; Manufacturer Part Number 1: E5280LF; Supplier 1: Rakon; Supplier Part Number 1: E5280LF
XO6 = Rakon_RTX5032A: Part Description: RTX5032A 40MHz, High performance TCXO, With VC, Filter Enabled, 10-pin 5mm x 3.2 mm x 1.65 mm package; Manufacturer: Rakon; Manufacturer Part Number 1: RTX5032A; Supplier Part Number 1: RTX5032A; Supplier 1: RAKON
XO7 = ASVTX-12-A-38.400MHZ-H10-T_CRYSTAL: Oscillator Crystal; Manufacturer: Abracon; Part Description: 38.4MHz VCTCXO Clipped Sine Wave Oscillator 3V  4-SMD, No Lead; Operating Supply Voltage: 3V; Frequency Stability: 1ppm; Max Supply Current: 2.5mA; Supplier 1: Digi-Key; Manufacturer Part Number 1: ASVTX-12-A-38.400MHZ-H10-T; Stock 1: 1680; Pricing 1: 1 = 3,58000, 10 = 3,41000, 50 = 3,23960, 100 = 2,89850, 500 = 2,72800 (USD); RoHS: Yes; Mount: Surface Mount; Case/Package: SMD/SMT; Min Operating Temperature: -30°C; Max Operating Temperature: 85°C; Frequency: 38.4MHz; Package Quantity: 1000; Packaging: Tape and Reel; Termination: SMD/SMT; Length: 0.098inch; Height: 0.035inch; Width: 0.079inch; ComponentLink1URL: https://datasheet.ciiva.com/5466/astx12-asvtx12-8609-5466673.pdf?src-supplier=Mouser; ComponentLink1Description: https://datasheet.ciiva.com/5466/astx12-asvtx12-8609-5466673.pdf?src-supplier=Mouser; ComponentLink2URL: https://datasheet.ciiva.com/867/astx12-asvtx12-867453.pdf?src-supplier=Digi-Key; ComponentLink2Description: https://datasheet.ciiva.com/867/astx12-asvtx12-867453.pdf?src-supplier=Digi-Key; ComponentLink3URL: https://datasheet.ciiva.com/867/astx12-asvtx12-867454.pdf?src-supplier=Digi-Key; ComponentLink3Description: https://datasheet.ciiva.com/867/astx12-asvtx12-867454.pdf?src-supplier=Digi-Key; ComponentLink4URL: https://datasheet.ciiva.com/867/astx12-asvtx12-867455.pdf?src-supplier=Digi-Key; ComponentLink4Description: https://datasheet.ciiva.com/867/astx12-asvtx12-867455.pdf?src-supplier=Digi-Key; Supplier Part Number 1: 535-11790-1-ND